# Altium schematic sheet protoboard.SchDoc: Hall / Main Board / Protoboard
size A4; DocumentNumber: 7; SheetNumber: 7; SheetTotal: 7
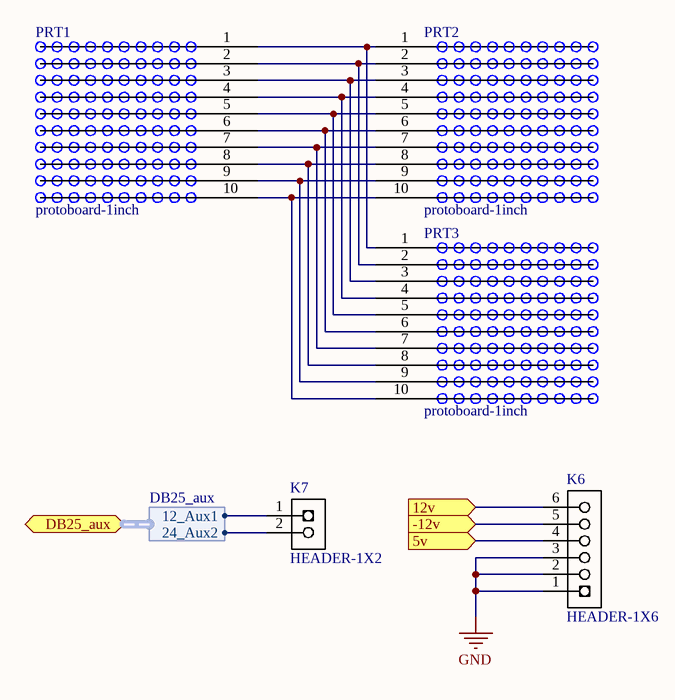
[diagram p0: protoboard.SchDoc]

## Parts
K6  HEADER-1X6  [HEADER-1X6]  (no BOM)
K7  HEADER-1X2  [HEADER-1X2]  (no BOM)
PRT1  protoboard-1inch  [protoboard-1inch]  (no BOM)
PRT2  protoboard-1inch  [protoboard-1inch]  (no BOM)
PRT3  protoboard-1inch  [protoboard-1inch]  (no BOM)

## Ports
5v (in), 12v (in), -12v (in), DB25_aux (harness DB25_aux)

## Harnesses
DB25_aux: 12_Aux1, 24_Aux2

## Nets
GND: K6.1 K6.2 K6.3
5v: K6.4 ; port 5v
12v: K6.6 ; port 12v
-12v: K6.5 ; port -12v
NetK7_1: K7.1 ; port DB25_aux.12_Aux1
NetK7_2: K7.2 ; port DB25_aux.24_Aux2
NetPRT1_1: PRT1.1 PRT2.1 PRT3.1
NetPRT1_2: PRT1.2 PRT2.2 PRT3.2
NetPRT1_3: PRT1.3 PRT2.3 PRT3.3
NetPRT1_4: PRT1.4 PRT2.4 PRT3.4
NetPRT1_5: PRT1.5 PRT2.5 PRT3.5
NetPRT1_6: PRT1.6 PRT2.6 PRT3.6
NetPRT1_7: PRT1.7 PRT2.7 PRT3.7
NetPRT1_8: PRT1.8 PRT2.8 PRT3.8
NetPRT1_9: PRT1.9 PRT2.9 PRT3.9
NetPRT1_10: PRT1.10 PRT2.10 PRT3.10

## Notes on the sheet
- Title
- Size:
- Date:
- A4
- Number:
- Time:
- Revision:
- Sheet
- of
- Fermium LABS srl
- Via Monselice 15a
- 35142 Padova PD
- Italy
- File:

## Library data of the parts
K7 = HEADER-1X2: REEL: TH; Supplier 1: Digi-Key; Supplier Part Number 1: S1011E-36-ND
K6 = HEADER-1X6: Supplier 1: Digi-Key; Supplier Part Number 1: S1011E-36-ND